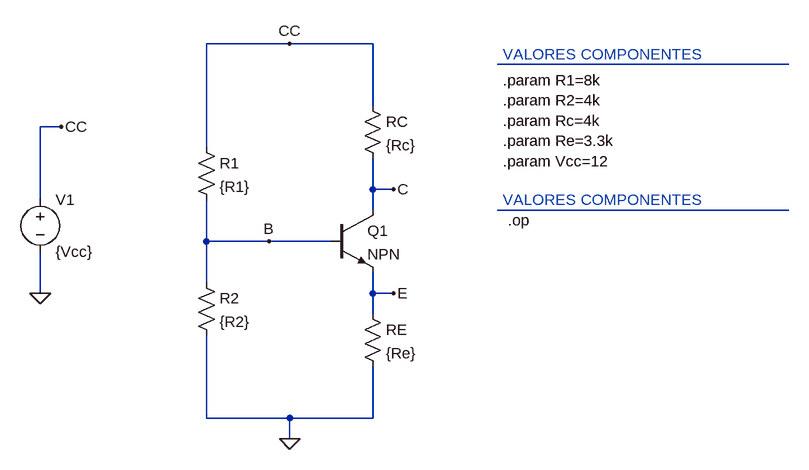
[diagram p0: schematic ejemplo1_D2.asc]
ejemplo1_D2.asc, the LTspice schematic file:
Version 4
SHEET 1 1064 680
WIRE 192 -128 64 -128
WIRE 320 -128 192 -128
WIRE 960 -96 512 -96
WIRE 320 -32 320 -128
WIRE -160 0 -192 0
WIRE 64 32 64 -128
WIRE 320 96 320 48
WIRE 352 96 320 96
WIRE -192 112 -192 0
WIRE 320 128 320 96
WIRE 960 128 512 128
WIRE 64 176 64 112
WIRE 160 176 64 176
WIRE 256 176 160 176
WIRE 64 240 64 176
WIRE -192 256 -192 192
WIRE 320 256 320 224
WIRE 352 256 320 256
WIRE 320 288 320 256
WIRE 64 448 64 320
WIRE 192 448 64 448
WIRE 320 448 320 368
WIRE 320 448 192 448
WIRE 192 480 192 448
FLAG -192 256 0
FLAG 192 480 0
FLAG 160 176 B
FLAG 352 96 C
FLAG 352 256 E
FLAG -160 0 CC
FLAG 192 -128 CC
SYMBOL voltage -192 96 R0
WINDOW 123 0 0 Left 0
WINDOW 39 0 0 Left 0
SYMATTR InstName V1
SYMATTR Value {Vcc}
SYMBOL res 48 16 R0
SYMATTR InstName R1
SYMATTR Value {R1}
SYMBOL res 48 224 R0
SYMATTR InstName R2
SYMATTR Value {R2}
SYMBOL res 304 -48 R0
SYMATTR InstName RC
SYMATTR Value {Rc}
SYMBOL res 304 272 R0
SYMATTR InstName RE
SYMATTR Value {Re}
SYMBOL npn 256 128 R0
SYMATTR InstName Q1
TEXT 520 -112 Left 2 ;VALORES COMPONENTES
TEXT 520 -72 Left 2 !.param R1=8k \n.param R2=4k \n.param Rc=4k \n.param Re=3.3k \n.param Vcc=12
TEXT 520 112 Left 2 ;VALORES COMPONENTES
TEXT 528 144 Left 2 !.op

The netlist it stands for:
* ejemplo1_D2.asc
V1 CC 0 {Vcc}
R1 CC B {R1}
R2 B 0 {R2}
RC CC C {Rc}
RE E 0 {Re}
Q1 C B E 0 NPN
.model NPN NPN
.model PNP PNP
.lib standard.bjt
* VALORES COMPONENTES
.param R1=8k
.param R2=4k
.param Rc=4k
.param Re=3.3k
.param Vcc=12
* VALORES COMPONENTES
.op
.backanno
.end